# Altium schematic sheet MCU.SchDoc
size 292 x 193 mm; Author: Power Lin; DocumentNumber: 2; SheetNumber: 2; SheetTotal: 4; Website: wiki-power.com
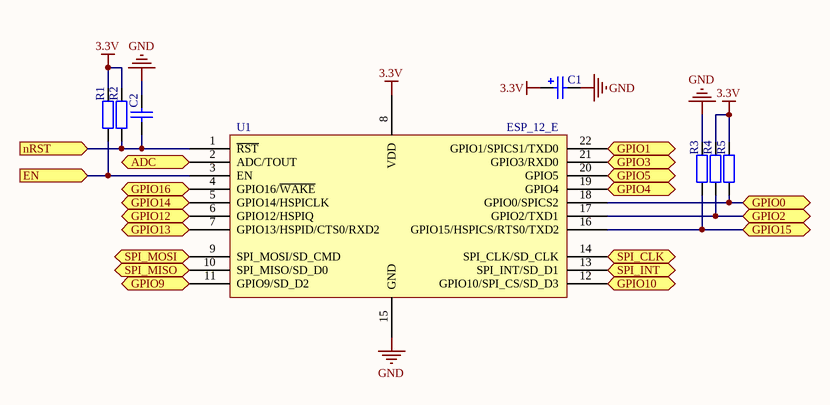
[diagram p0: MCU.SchDoc]

## Parts
C1  100uF  [CASE-B_3528]  (value not drawn)
C2  100nF  [CAP-0603]  (value not drawn)
R1  12K  [R-0603]  (value not drawn)
R2  12K  [R-0603]  (value not drawn)
R3  12K  [R-0603]  (value not drawn)
R4  12K  [R-0603]  (value not drawn)
R5  12K  [R-0603]  (value not drawn)
U1  ESP_12_E  [ESP_12_E_L]

## Ports
ADC (bidir), EN (in), GPIO0 (bidir), GPIO1 (bidir), GPIO2 (bidir), GPIO3 (bidir), GPIO4 (bidir), GPIO5 (bidir), GPIO9 (bidir), GPIO10 (bidir), GPIO12 (bidir), GPIO13 (bidir), GPIO14 (bidir), GPIO15 (bidir), GPIO16 (bidir), nRST (in), SPI_CLK (bidir), SPI_INT (bidir), SPI_MISO (bidir), SPI_MOSI (bidir)

## Nets
3.3V: C1.1 R1.2 R2.2 R4.2 R5.2 U1.8(VDD)
GND: C1.2 C2.2 R3.2 U1.15(GND)
ADC: U1.2(ADC/TOUT) ; port ADC
EN: R1.1 U1.3(EN) ; port EN
GPIO0: R5.1 U1.18(GPIO0/SPICS2) ; port GPIO0
GPIO1: U1.22(GPIO1/SPICS1/TXD0) ; port GPIO1
GPIO2: R4.1 U1.17(GPIO2/TXD1) ; port GPIO2
GPIO3: U1.21(GPIO3/RXD0) ; port GPIO3
GPIO4: U1.19(GPIO4) ; port GPIO4
GPIO5: U1.20(GPIO5) ; port GPIO5
GPIO9: U1.11(GPIO9/SD_D2) ; port GPIO9
GPIO10: U1.12(GPIO10/SPI_CS/SD_D3) ; port GPIO10
GPIO12: U1.6(GPIO12/HSPIQ) ; port GPIO12
GPIO13: U1.7(GPIO13/HSPID/CTS0/RXD2) ; port GPIO13
GPIO14: U1.5(GPIO14/HSPICLK) ; port GPIO14
GPIO15: R3.1 U1.16(GPIO15/HSPICS/RTS0/TXD2) ; port GPIO15
GPIO16: U1.4(GPIO16/~{WAKE}) ; port GPIO16
nRST: C2.1 R2.1 U1.1(~{RST}) ; port nRST
SPI_CLK: U1.14(SPI_CLK/SD_CLK) ; port SPI_CLK
SPI_INT: U1.13(SPI_INT/SD_D1) ; port SPI_INT
SPI_MISO: U1.10(SPI_MISO/SD_D0) ; port SPI_MISO
SPI_MOSI: U1.9(SPI_MOSI/SD_CMD) ; port SPI_MOSI

## Notes on the sheet
- Author
- DocumentName
- ModifiedDate
- ProjectName
- SheetNumber
- SheetTotal
- Website
- Revision

## Library data of the parts
C1 = CAP-POL: 贴片电容-有极性; ComponentLink1Description: 供应商链接; ComponentLink1URL: http://www.szlcsc.com/product/details_16815.html; Package: 3528; Supplier: LC; SuppliersPartNumber: C16133
C2 = CAP: 贴片电容; ComponentLink1Description: 供应商链接; ComponentLink1URL: http://www.szlcsc.com/product/details_53938.html; Package: 0402; Supplier: LC; SuppliersPartNumber: C52923
R1-R5 = RES: 贴片电阻; Package: 0805; Supplier: LC; SuppliersPartNumber: C17798
U1 = ESP_12_E: ESP-12 Wi-Fi Module by AI-Thinker; IC: ESP8266-EX; Vendor: Ai-thinker